# Altium schematic sheet MainBoard_V100_MEM.SchDoc
size A4; SheetNumber: 11; SheetTotal: 19; Title_: External EEPROM Memory
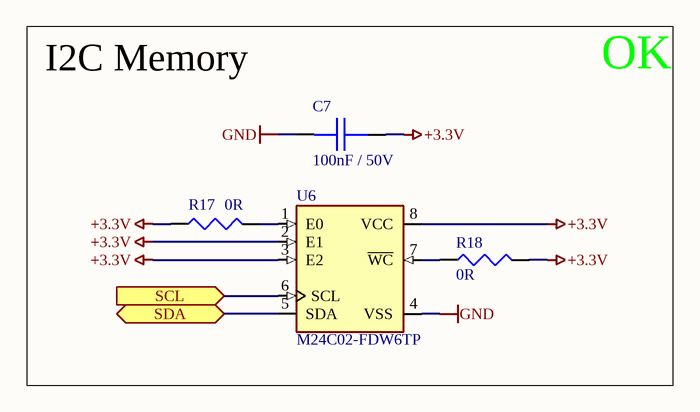
[diagram p0: MainBoard_V100_MEM.SchDoc]

## Parts
C7  100nF / 50V  [0805_C]
R17  0R  [0805]
R18  0R  [0805]
U6  M24C02-FDW6TP  [TSSOP-8]

## Ports
SCL (in), SDA (bidir)

## Nets
+3.3V: C7.2 R17.1 R18.2 U6.2(E1) U6.3(E2) U6.8(VCC)
GND: C7.1 U6.4(VSS)
SCL: U6.6(SCL) ; port SCL
SDA: U6.5(SDA) ; port SDA
NetR17_2: R17.2 U6.1(E0)
NetR18_1: R18.1 U6.7(~{WC})

## Notes on the sheet
- I2C Memory
- OK
- Board:
- Author:
- Title:
- Project:
- SVN:
- Version:
- Sheet:
- of
- Contact:
- Modified:
- Size:
- A4

## Library data of the parts
C7 = 149: 100nF 50V X7R; Part Number: SMD0805-100nF-50V; Azonosító: 149; Category: Passives; Subcategory: PASS_Capacitor; Supplier 1: HESTORE; Supplier 1 order number: 100.011.22
R17 R18 = 38: 0R 0805 0.125W 5%; Part Number: 0 R 5%; Azonosító: 38; Category: Passives; Subcategory: PASS_Resistor; Supplier 1: HESTORE; Supplier 1 order number: 100.275.70
U6 = 345: EEPROM Memory IC 2Kb (256 x 8) I2C 400kHz 900ns 8-TSSOP; MF: STMicroelectronics; Azonosító: 345; Package: TSSOP-8 STMicroelectronics; MP: M24C02-FDW6TP; Digi-Key_Part_Number: 497-15746-1-ND; Value: *; SnapEDA_Link: https://www.snapeda.com/parts/M24C02-FDW6TP/STMicroelectronics/view-part/1102461/?ref=snap; Part Number: M24C02-FDW6TP; Category: Integrated Circuits; Subcategory: IC_Memory; Supplier 1: MOUSER; Supplier 1 order number: 511-M24C02-FDW6TP; Help URL: https://www.st.com/resource/en/datasheet/m24c01-w.pdf